# Altium schematic sheet top_level.SchDoc
size 381 x 190 mm; SheetNumber: 1; SheetTotal: 2
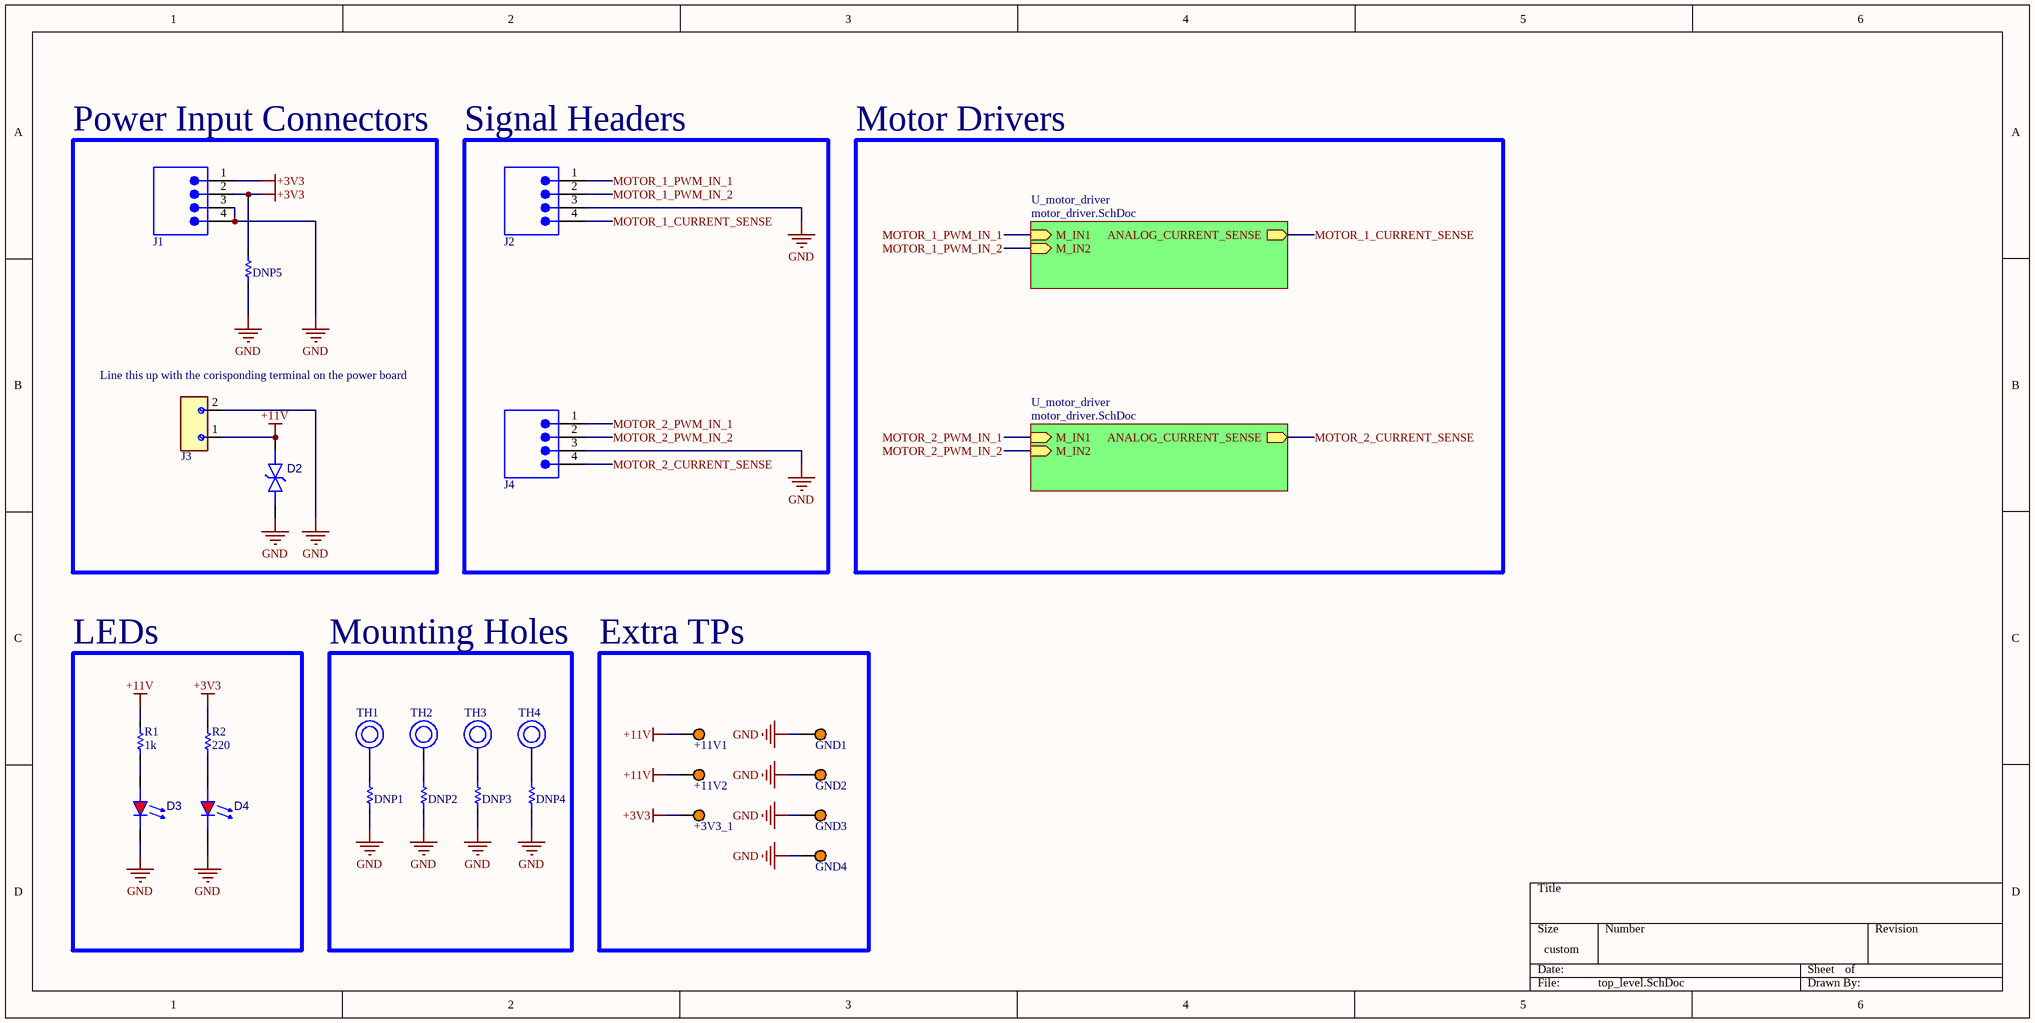
[diagram p0: top_level.SchDoc]

## Parts
+3V3_1  TP - 5008 (Compact)  [5008 - Keystone Compact Footprint]  (value not drawn)
+11V1  TP - 5008 (Compact)  [5008 - Keystone Compact Footprint]  (value not drawn)
+11V2  TP - 5008 (Compact)  [5008 - Keystone Compact Footprint]  (value not drawn)
D2  D - SMAJ15CA  [D - SMAJ15CA]  (value not drawn)
D3  D - LTST-C193KRKT-5A  [LED 0603]  (value not drawn)
D4  D - LTST-C193KRKT-5A  [LED 0603]  (value not drawn)
DNP1  DNP - DNP PAD 0603  [DNP 0603]  (value not drawn)
DNP2  DNP - DNP PAD 0603  [DNP 0603]  (value not drawn)
DNP3  DNP - DNP PAD 0603  [DNP 0603]  (value not drawn)
DNP4  DNP - DNP PAD 0603  [DNP 0603]  (value not drawn)
DNP5  DNP - DNP PAD 0603  [DNP 0603]  (value not drawn)
GND1  TP - 5008 (Compact)  [5008 - Keystone Compact Footprint]  (value not drawn)
GND2  TP - 5008 (Compact)  [5008 - Keystone Compact Footprint]  (value not drawn)
GND3  TP - 5008 (Compact)  [5008 - Keystone Compact Footprint]  (value not drawn)
GND4  TP - 5008 (Compact)  [5008 - Keystone Compact Footprint]  (value not drawn)
J1  Copy of SMTC-TSW-106-07-X-D_1  [J - 61300411121]  (value not drawn)
J2  Copy of SMTC-TSW-106-07-X-D_1  [J - 61300411121]  (value not drawn)
J3  J - 691137710002  [J - 691137710002]  (value not drawn)
J4  Copy of SMTC-TSW-106-07-X-D_1  [J - 61300411121]  (value not drawn)
R1  value 1k  [RES 0603]  (hidden comment: ERJ-PB3B1001V)
R2  value 220  [RES 0603]  (hidden comment: R - RES 220R 0.33W 1% 0603)
TH1  TH - M3 Mounting Hole  [M3 Mounting]  (value not drawn)
TH2  TH - M3 Mounting Hole  [M3 Mounting]  (value not drawn)
TH3  TH - M3 Mounting Hole  [M3 Mounting]  (value not drawn)
TH4  TH - M3 Mounting Hole  [M3 Mounting]  (value not drawn)

## Blocks framed on the sheet
Power Input Connectors: D2 DNP5 J1 J3
Signal Headers: J2 J4
LEDs: D3 D4 R1 R2
Mounting Holes: DNP1-DNP4 TH1-TH4
Extra TPs: +3V3_1 +11V1 +11V2 GND1-GND4

## Sub-sheets
U_motor_driver = motor_driver.SchDoc: M_IN1 (in), M_IN2 (in), ANALOG_CURRENT_SENSE (out)
U_motor_driver = motor_driver.SchDoc: M_IN1 (in), M_IN2 (in), ANALOG_CURRENT_SENSE (out)

## Nets
+3V3: +3V3_1.1 DNP5.2 J1.1 J1.2 R2.2
+11V: +11V1.1 +11V2.1 D2.2(A) J3.1 R1.2
GND: D2.1(K) D3.2(K) D4.2(K) DNP1.2 DNP2.2 DNP3.2 DNP4.2 DNP5.1 GND1.1 GND2.1 GND3.1 GND4.1 J1.3 J1.4 J2.3 J3.2 J4.3
MOTOR_1_CURRENT_SENSE: J2.4 ; sheet U_motor_driver/ANALOG_CURRENT_SENSE
MOTOR_1_PWM_IN_1: J2.1 ; sheet U_motor_driver/M_IN1
MOTOR_1_PWM_IN_2: J2.2 ; sheet U_motor_driver/M_IN2
MOTOR_2_CURRENT_SENSE: J4.4 ; sheet U_motor_driver/ANALOG_CURRENT_SENSE
MOTOR_2_PWM_IN_1: J4.1 ; sheet U_motor_driver/M_IN1
MOTOR_2_PWM_IN_2: J4.2 ; sheet U_motor_driver/M_IN2
NetD3_1: D3.1(A) R1.1
NetD4_1: D4.1(A) R2.1
NetDNP1_1: DNP1.1 TH1.1
NetDNP2_1: DNP2.1 TH2.1
NetDNP3_1: DNP3.1 TH3.1
NetDNP4_1: DNP4.1 TH4.1

## Notes on the sheet
- Motor Drivers
- (near J3) Line this up with the corisponding terminal on the power board

## Library data of the parts
+3V3_1 +11V1 +11V2 GND1-GND4 = TP - 5008 (Compact): 5008 - Orange PC Test Point, Compact Phosphor Bronze Silver Plating Through Hole Mounting Type
D2 = D - SMAJ15CA: SMAJ15CA - 24.4V Clamp 16.4A Ipp Tvs Diode Surface Mount DO-214AC (SMA)
D3 D4 = D - LTST-C193KRKT-5A: LTST-C193KRKT-5A - Red 631nm LED Indication - Discrete 2V 0603 (1608 Metric)
J1 J2 J4 = J - 61300411121: 61300411121 - Connector Header Through Hole 4 position 0.100" (2.54mm)
J3 = J - 691137710002: 691137710002 - 2 Position Wire to Board Terminal Block Horizontal with Board 0.197" (5.00mm) Through Hole
R1 = R - RES 1kR 0.2W 0.1% 0603: ERJ-PB3B1001V - 1 kOhms ±0.1% 0.2W, 1/5W Chip Resistor 0603 (1608 Metric) Automotive AEC-Q200 Thick Film
R2 = R - RES 220R 0.33W 1% 0603: ERJ-PA3F2200V - 220 Ohms ±1% 0.333W, 1/3W Chip Resistor 0603 (1608 Metric) Automotive AEC-Q200, Pulse Withstanding Thick Film